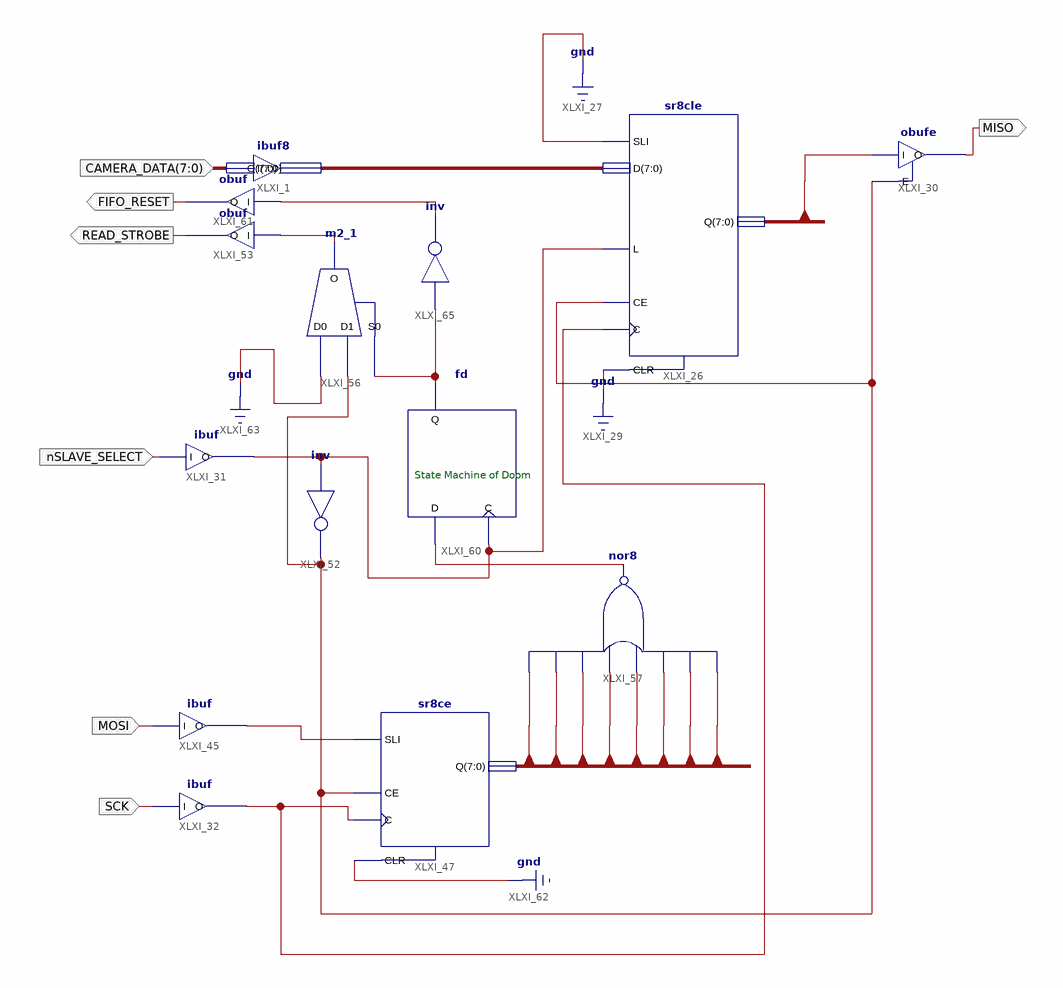
[diagram p0: schematic sheet 1]
// Xilinx ISE schematic skosnoere.sch (xc9500xl) as structural Verilog: 14 symbols, 7 ports
module skosnoere (
  input  [7:0] CAMERA_DATA,
  input  nSLAVE_SELECT,
  input  MOSI,
  input  SCK,
  output READ_STROBE,
  output MISO,
  output FIFO_RESET
);

  wire XLXN_38, XLXN_56, XLXN_69, XLXN_90, XLXN_94, XLXN_99, XLXN_106, XLXN_107;
  wire [7:0] MOSI_P, shift_out, XLXN_6;

  ibuf8 XLXI_1 (.I(CAMERA_DATA), .O(XLXN_6));
  sr8cle XLXI_26 (.C(XLXN_90), .CE(XLXN_94), .CLR(1'b0), .D(XLXN_6), .L(XLXN_38), .SLI(1'b0), .Q(shift_out));
  ibuf XLXI_31 (.I(nSLAVE_SELECT), .O(XLXN_38));
  sr8ce XLXI_47 (.C(XLXN_90), .CE(XLXN_94), .CLR(1'b0), .SLI(XLXN_56), .Q(MOSI_P));
  not XLXI_52 (XLXN_94, XLXN_38);
  obuf XLXI_53 (.I(XLXN_69), .O(READ_STROBE));
  m2_1 XLXI_56 (.D0(1'b0), .D1(XLXN_94), .S0(XLXN_106), .O(XLXN_69));
  nor XLXI_57 (XLXN_99, MOSI_P[7], MOSI_P[6], MOSI_P[5], MOSI_P[4], MOSI_P[3], MOSI_P[2], MOSI_P[1], MOSI_P[0]);
  ibuf XLXI_45 (.I(MOSI), .O(XLXN_56));
  ibuf XLXI_32 (.I(SCK), .O(XLXN_90));
  fd XLXI_60 (.C(XLXN_38), .D(XLXN_99), .Q(XLXN_106));
  obuf XLXI_61 (.I(XLXN_107), .O(FIFO_RESET));
  obufe XLXI_30 (.E(XLXN_94), .I(shift_out[7]), .O(MISO));
  not XLXI_65 (XLXN_107, XLXN_106);

  // Notes on the sheet:
  //   State Machine of Doom
endmodule
